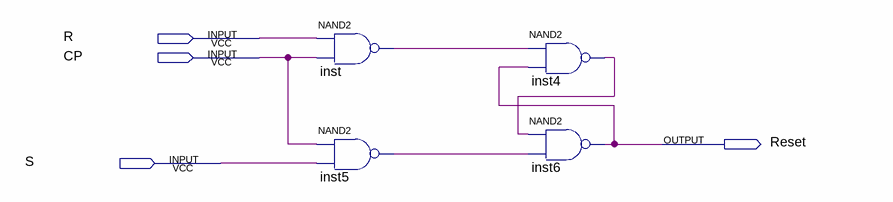
[diagram p0: schematic sheet]
// Quartus schematic RS-Latch.bdf as structural Verilog: 4 symbols, 4 pins
module \RS-Latch  (
  input  R,
  input  CP,
  input  S,
  output Reset
);

  wire inst4_out, inst5_out, inst_out;

  nand inst (inst_out, R, CP);
  nand inst5 (inst5_out, CP, S);
  nand inst4 (inst4_out, inst_out, Reset);
  nand inst6 (Reset, inst4_out, inst5_out);
endmodule
